# Altium project VoltageInput.PrjPcb
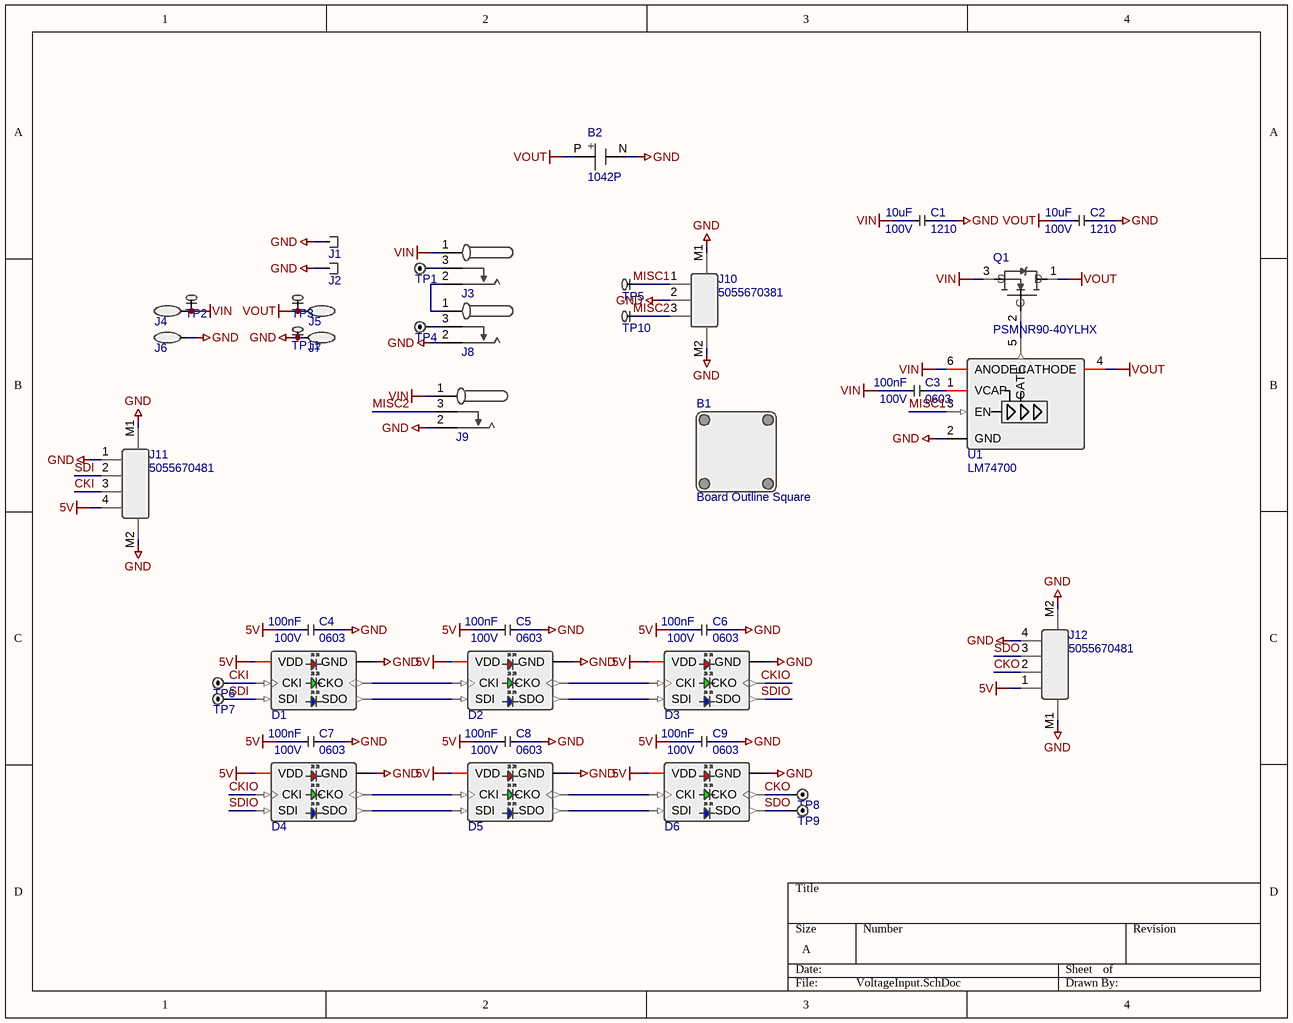
[diagram p0: VoltageInput.SchDoc]
1 sheet, 42 parts. Net scope: global (net labels, ports and power ports of the same name join across sheets).
Board file: VoltageInput.PcbDoc

## Sheet VoltageInput.SchDoc
size A; SheetNumber: 1; SheetTotal: 1

### Parts
B1  Board Outline Square  [PCB_OUTLINE_SQUARE]
B2  1042P
C1  value 10uF  Voltage - Rated: 100V  Package/Case Imperial: 1210  [CAPACITOR_1210(3225)_GENERIC]  (hidden comment: Capacitor - Ceramic - Generic)
C2  value 10uF  Voltage - Rated: 100V  Package/Case Imperial: 1210  [CAPACITOR_1210(3225)_GENERIC]  (hidden comment: Capacitor - Ceramic - Generic)
C3  value 100nF  Voltage - Rated: 100V  Package/Case Imperial: 0603  [CAPACITOR_0603(1608)_GENERIC]  (hidden comment: Capacitor - Ceramic - Generic)
C4  value 100nF  Voltage - Rated: 100V  Package/Case Imperial: 0603  [CAPACITOR_0603(1608)_GENERIC]  (hidden comment: Capacitor - Ceramic - Generic)
C5  value 100nF  Voltage - Rated: 100V  Package/Case Imperial: 0603  [CAPACITOR_0603(1608)_GENERIC]  (hidden comment: Capacitor - Ceramic - Generic)
C6  value 100nF  Voltage - Rated: 100V  Package/Case Imperial: 0603  [CAPACITOR_0603(1608)_GENERIC]  (hidden comment: Capacitor - Ceramic - Generic)
C7  value 100nF  Voltage - Rated: 100V  Package/Case Imperial: 0603  [CAPACITOR_0603(1608)_GENERIC]  (hidden comment: Capacitor - Ceramic - Generic)
C8  value 100nF  Voltage - Rated: 100V  Package/Case Imperial: 0603  [CAPACITOR_0603(1608)_GENERIC]  (hidden comment: Capacitor - Ceramic - Generic)
C9  value 100nF  Voltage - Rated: 100V  Package/Case Imperial: 0603  [CAPACITOR_0603(1608)_GENERIC]  (hidden comment: Capacitor - Ceramic - Generic)
D1  APA102C  [5X5MM(6PIN)_JLEAD_GENERIC]  (value not drawn)
D2  APA102C  [5X5MM(6PIN)_JLEAD_GENERIC]  (value not drawn)
D3  APA102C  [5X5MM(6PIN)_JLEAD_GENERIC]  (value not drawn)
D4  APA102C  [5X5MM(6PIN)_JLEAD_GENERIC]  (value not drawn)
D5  APA102C  [5X5MM(6PIN)_JLEAD_GENERIC]  (value not drawn)
D6  APA102C  [5X5MM(6PIN)_JLEAD_GENERIC]  (value not drawn)
J1  PP45 Staple  [CONNECTOR_ACCESSORY_PP45-STAPLE_ANDERSON]  (value not drawn)
J2  PP45 Staple  [CONNECTOR_ACCESSORY_PP45-STAPLE_ANDERSON]  (value not drawn)
J3  839-1508-ND  [CONNECTOR_BARREL_TENSILITY_839-1508-ND]  (value not drawn)
J4  PP45  [CONNECTOR_BTOC_PP45_ANDERSON]  (value not drawn)
J5  PP45  [CONNECTOR_BTOC_PP45_ANDERSON]  (value not drawn)
J6  PP45  [CONNECTOR_BTOC_PP45_ANDERSON]  (value not drawn)
J7  PP45  [CONNECTOR_BTOC_PP45_ANDERSON]  (value not drawn)
J8  839-1508-ND  [CONNECTOR_BARREL_TENSILITY_839-1508-ND]  (value not drawn)
J9  839-1508-ND  [CONNECTOR_BARREL_TENSILITY_839-1508-ND]  (value not drawn)
J10  Manufacturer Part Number 1: 5055670381  [CONNECTOR_HEADER_MOLEX_5055670381]  (hidden comment: Connector - Header - 3P 2M - Generic)
J11  Manufacturer Part Number 1: 5055670481  [CONNECTOR_HEADER_MOLEX_5055670481]  (hidden comment: Connector - Header - 4P 2M - Generic)
J12  Manufacturer Part Number 1: 5055670481  [CONNECTOR_HEADER_MOLEX_5055670481]  (hidden comment: Connector - Header - 4P 2M - Generic)
Q1  PSMNR90-40YLHX  [SOT1023(LFPAK56E)_NEXPERIA]
TP1  Test Point - THT  [TESTPOINT_THT_OCTAGON]  (value not drawn)
TP2  519XTR  [TESTPOINT_LOOP_SMD_KEYSTONE_519X]  (value not drawn)
TP3  519XTR  [TESTPOINT_LOOP_SMD_KEYSTONE_519X]  (value not drawn)
TP4  Test Point - THT  [TESTPOINT_THT_OCTAGON]  (value not drawn)
TP5  519XTR  [TESTPOINT_LOOP_SMD_KEYSTONE_519X]  (value not drawn)
TP6  Test Point - THT  [TESTPOINT_THT_OCTAGON]  (value not drawn)
TP7  Test Point - THT  [TESTPOINT_THT_OCTAGON]  (value not drawn)
TP8  Test Point - THT  [TESTPOINT_THT_OCTAGON]  (value not drawn)
TP9  Test Point - THT  [TESTPOINT_THT_OCTAGON]  (value not drawn)
TP10  519XTR  [TESTPOINT_LOOP_SMD_KEYSTONE_519X]  (value not drawn)
TP11  519XTR  [TESTPOINT_LOOP_SMD_KEYSTONE_519X]  (value not drawn)
U1  LM74700  [SOT23-6(DBV0006A)_TI]

### Nets
5V: C4.1 C5.1 C6.1 C7.1 C8.1 C9.1 D1.4(VDD) D2.4(VDD) D3.4(VDD) D4.4(VDD) D5.4(VDD) D6.4(VDD) J11.4 J12.1
GND: B2.N C1.2 C2.2 C4.2 C5.2 C6.2 C7.2 C8.2 C9.2 D1.3(GND) D2.3(GND) D3.3(GND) D4.3(GND) D5.3(GND) D6.3(GND) J1.1 J2.1 J6.1 J7.1 J8.2 J9.2 J10.2 J10.M1 J10.M2 J11.1 J11.M1 J11.M2 J12.4 J12.M1 J12.M2 TP11.1 U1.2(GND)
VIN: C1.1 C3.1 J3.1 J4.1 J9.1 Q1.3(S) TP2.1 U1.6(ANODE)
VOUT: B2.P C2.1 J5.1 Q1.1(D) TP3.1 U1.4(CATHODE)
CKI: D1.2(CKI) J11.3 TP6.1
CKIO: D3.5(CKO) D4.2(CKI)
CKO: D6.5(CKO) J12.2 TP8.1
MISC1: J10.1 TP5.1 U1.3(EN)
MISC2: J9.3 J10.3 TP10.1
SDI: D1.1(SDI) J11.2 TP7.1
SDIO: D3.6(SDO) D4.1(SDI)
SDO: D6.6(SDO) J12.3 TP9.1
NetC3_2: C3.2 U1.1(VCAP)
NetD1_5: D1.5(CKO) D2.2(CKI)
NetD1_6: D1.6(SDO) D2.1(SDI)
NetD2_5: D2.5(CKO) D3.2(CKI)
NetD2_6: D2.6(SDO) D3.1(SDI)
NetD4_5: D4.5(CKO) D5.2(CKI)
NetD4_6: D4.6(SDO) D5.1(SDI)
NetD5_5: D5.5(CKO) D6.2(CKI)
NetD5_6: D5.6(SDO) D6.1(SDI)
NetJ3_2: J3.2 J8.1
NetJ3_3: J3.3 TP1.1
NetJ8_3: J8.3 TP4.1
NetQ1_2: Q1.2(G) U1.5(GATE)

### Notes on the sheet
- (in symbol Battery - Holder - Keystone 1042P) +

### Library data of the parts
B1 = Board_Outline_Square
B2 = Battery - Holder - Keystone 1042P: Supplier 1: Digi-Key; Supplier Part Number 1: 36-1042P-ND; Supplier 2: Mouser; Supplier Part Number 2: 534-1042P
C1 C2 = CAP-CER_10UF_100V_20%_X7S_1210(3225): 10uF ±20% 100V Ceramic Capacitor X7S 1210(3225 Metric); Manufacturer 1: Murata Electronics; Manufacturer Part Number 1: GRM32EC72A106ME05L; Manufacturer Lifecycle 1: Active; Package/Case Metric: 3225; Name: CAP-CER_10UF_100V_20%_X7S_1210(3225); Item: CAP-CER; Temperature Coefficient: X7S; Tolerance: 20%; Mounting Type: SMT; Full Item: Ceramic Capacitor; Manufacturer 2: Murata Electronics; Manufacturer Part Number 2: GRM32EC72A106KE05L; Manufacturer Lifecycle 2: Active; Manufacturer 3: Murata Electronics; Manufacturer Part Number 3: GRM32EC72A106KE05K; Manufacturer Lifecycle 3: Active
C3-C9 = CAP-CER_100NF_100V_20%_X7R_0603(1608): 100nF ±20% 100V Ceramic Capacitor X7R 0603(1608 Metric); Manufacturer 1: Murata Electronics; Manufacturer Part Number 1: GRM188R72A104KA35D; Manufacturer Lifecycle 1: Active; Package/Case Metric: 1608; Name: CAP-CER_100NF_100V_20%_X7R_0603(1608); Item: CAP-CER; Temperature Coefficient: X7R; Tolerance: 20%; Mounting Type: SMT; Full Item: Ceramic Capacitor; Manufacturer 2: Murata Electronics; Manufacturer Part Number 2: GRM188R72A104KA35J; Manufacturer Lifecycle 2: Active; Manufacturer 3: Murata Electronics; Manufacturer Part Number 3: GRM188R72A104MA35D; Manufacturer Lifecycle 3: Active
D1-D6 = Diode - LED - Addressable - 5x5mm APA102C: Supplier 1: Digi-Key; Supplier Part Number 1: 1568-COM-16345-ND; Supplier 2: Mouser; Supplier Part Number 2: 474-COM-16345
J1 J2 = Connector - Accessory - Mechanical Support - Anderson PP45 Staple
J3 J8 J9 = Connector - Barrel - 3.5mmx1.1mm - Tensility 839-1508-ND: Supplier 1: Digi-Key; Supplier Part Number 1: 839-1508-ND
J4-J7 = Connector - Modular - 1P - Anderson PP45
J10 = CON_HDR_3P_1.25MM-PITCH_50V_2.4A_SMT_MOLEX_5055670381: Connector Header 3 Pin 1.25mm Pitch Mating 50V 2.4A Rated 5 Walls Shrouded SMT Molex 5055670381; Manufacturer Lifecycle 1: Active; Number of Positions: 3; Shrouding: 5 Walls; Name: CON_HDR_3P_1.25MM-PITCH_50V_2.4A_SMT_MOLEX_5055670381; Item: CON_HDR; Pitch - Mating: 1.25mm; Fastening Type: Locking Ramp; Voltage - Max: 50V; Current - Max: 2.4A; Mounting Type: SMT; Full Item: Connector Header; Manufacturer 1: Molex
J11 J12 = CON_HDR_4P_1.25MM-PITCH_50V_2.4A_SMT_MOLEX_5055670481: Connector Header 4 Pin 1.25mm Pitch Mating 50V 2.4A Rated 6 Walls Shrouded SMT Molex 5055670481; Manufacturer Lifecycle 1: Active; Number of Positions: 4; Shrouding: 6 Walls; Name: CON_HDR_4P_1.25MM-PITCH_50V_2.4A_SMT_MOLEX_5055670481; Item: CON_HDR; Pitch - Mating: 1.25mm; Fastening Type: Locking Ramp; Voltage - Max: 50V; Current - Max: 2.4A; Mounting Type: SMT; Full Item: Connector Header; Manufacturer 1: Molex
Q1 = MOSFET - N Channel - Nexperia PSMNR90-40YLHX: Supplier 1: Digi-Key; Supplier Part Number 1: 1727-8710-1-ND; Supplier 2: Digi-Key; Supplier Part Number 2: 1727-8710-6-ND; Supplier 3: Mouser; Supplier Part Number 3: 771-PSMNR90-40YLHX
TP2 TP3 TP5 TP10 TP11 = Test Point - SMT - Loop - Keystone 519X
U1 = IC - Power Management - Ideal Diode Controller - TI LM74700: Supplier 1: Mouser; Supplier Part Number 1: 595-LM74700QDBVTQ1; Supplier 2: Texas Instruments; Supplier Part Number 2: LM74700QDBVTQ1; Supplier 3: Digi-Key; Supplier Part Number 3: 296-53420-1-ND; Supplier 4: Digi-Key; Supplier Part Number 4: 296-53420-6-ND